# Altium schematic sheet Sheet1.SchDoc
size A4
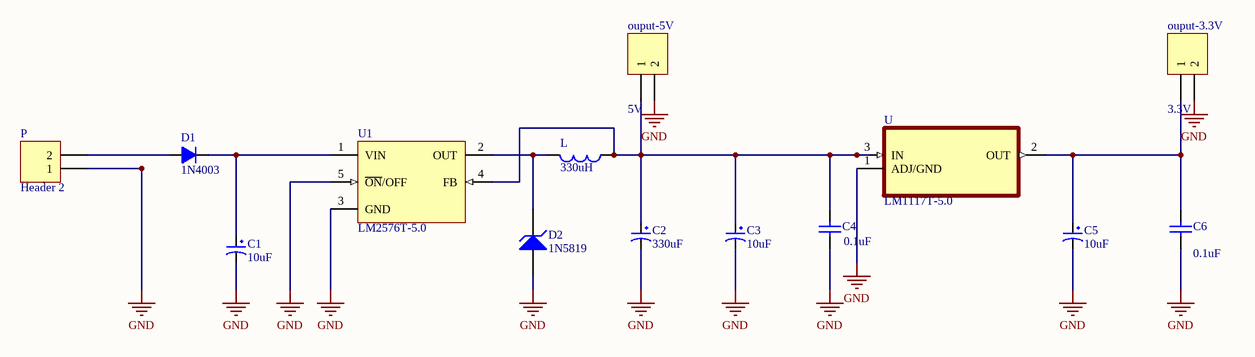
[diagram p0: Sheet1.SchDoc]

## Parts
C1  10uF  [CP1/2]
C2  330uF  [CP1.5/3.4]
C3  10uF  [CP1/2]
C4  value 0.1uF  [C3MM]
C5  10uF  [CP1/2]
C6  value 0.1uF  [C3MM]
D1  1N4003  [D1A]
D2  1N5819  [DIODE/NOM/0.5A]
L  330uH  [L/0.4]
ouput-3.3V  3.3V  [HDR1X2]
ouput-5V  5V  [HDR1X2]
P  Header 2  [HDR1X2]
U  LM1117T-5.0  [TO254P470X1016X2222-3P]
U1  LM2576T-5.0  [LM2576t]

## Nets
GND: C1.2 C2.2 C3.2 C4.1 C5.2 C6.1 D2.1(A) ouput-3.3V.2 ouput-5V.2 P.1 U.1(ADJ/GND) U1.3(GND) U1.5(~{ON}/OFF)
NetC1_1: C1.1 D1.2(K) U1.1(VIN)
NetC2_1: C2.1 C3.1 C4.2 L.1 ouput-5V.1 U.3(IN) U1.4(FB)
NetC5_1: C5.1 C6.2 ouput-3.3V.1 U.2(OUT)
NetD1_1: D1.1(A) P.2
NetD2_2: D2.2(K) L.2 U1.2(OUT)

## Library data of the parts
C1 C3 C5 = CP1: Cap P  0,1uF < 22uF , 16 - 50V; Value: 10uF/50V; Description 1: 10 => 220uF/6,3V/10V - 10uF => 100uF/16V; Description 2: 0,1uF => 33uF/50V - 10uF => 22uF/63V; Description 3: 0,47uF => 10uF/100V
C2 = CP3: Cap 100uF/35V - 470uF/16V; Value: 100uF/35V/50V; Description 1: 1000uF/6,3V - 470uF/16V - 330uF - 25V; Description 2: 220uF/35V - 100uF/50V - 63V - 4,7uF/200V; Description 3: 22uF => 33uF100V - 3,3uF => 4,7uF/250V; Description 4: 2,2uF =>3,3uF/350 - 2,2uF/400V - 1uF/450V
C4 C6 = Cap: Capacitor; Published: 8-Jun-2000; LatestRevisionDate: 17-Jul-2002; LatestRevisionNote: Re-released for DXP Platform.; PackageReference: RAD-0.3; Publisher: Altium Limited
D1 = D1A: Diode 1A; Value: 1N4007
D2 = Diode Zener: Zener Diode; Published: 8-Jun-2000; LatestRevisionDate: 17-Jul-2002; LatestRevisionNote: Re-released for DXP Platform.; PackageReference: DIODE-0.7; Publisher: Altium Limited
L = L1: Inductor; Value: 150 mH
ouput-3.3V ouput-5V P = Header 2: Header, 2-Pin; LatestRevisionDate: 17-Jul-2002; LatestRevisionNote: Re-released for DXP Platform.; Publisher: Altium Limited
U = LM1117T-5.0: Linear Voltage Regulator IC 1 Output 800mA TO-220-3; MF: Texas Instruments; MP: LM1117T50; Price: None; Value: *; Package: None; Availability: Unavailable; SnapEDA_Link: https://www.snapeda.com/parts/LM1117T50/Texas%20Instruments/view-part/53993/?ref=snap
U1 = LM2576T-5.0: SIMPLE SWITCHER; 3A Step-Down Voltage Regulator; Manufacturer: National Semiconductor; PackageTopMarking: NSUZXYTT*LM2576T*-5.0 P+; PowerWise: N; FirstPublished: 4-Dec-2008; DatasheetVersion: Aug-2004; PackageVersion: revJ, Jan-1992; PackageReference: T05A; Publisher: Altium Limited; PackageDescription: TO-220, Molded, 5 Lead, Straight; CompType: Switcher; PartNumber: LM2576T-5.0; RoHS: O; PinCount: 5; DigiKeyPartNumber: LM2576T-5.0-ND; Code_JEDEC: TO-220-AB; ComponentLink1Description: LM2576 Datasheet; ComponentLink1URL: http://www.national.com/ds/LM/LM2576.pdf; ComponentLink2Description: LM2576 Web Page; ComponentLink2URL: http://www.national.com/pf/LM/LM2576.html; ComponentLink3Description: T05A Package Page; ComponentLink3URL: http://www.national.com/packaging/folders/t05a.html